# Altium schematic sheet RotorStator_PowerControl.SchDoc
size 431 x 279 mm; Date: 20260623; Author: YYC; CompanyName: M-Waves; SheetNumber: 1; SheetTotal: 1; SCH_SCALE: A3
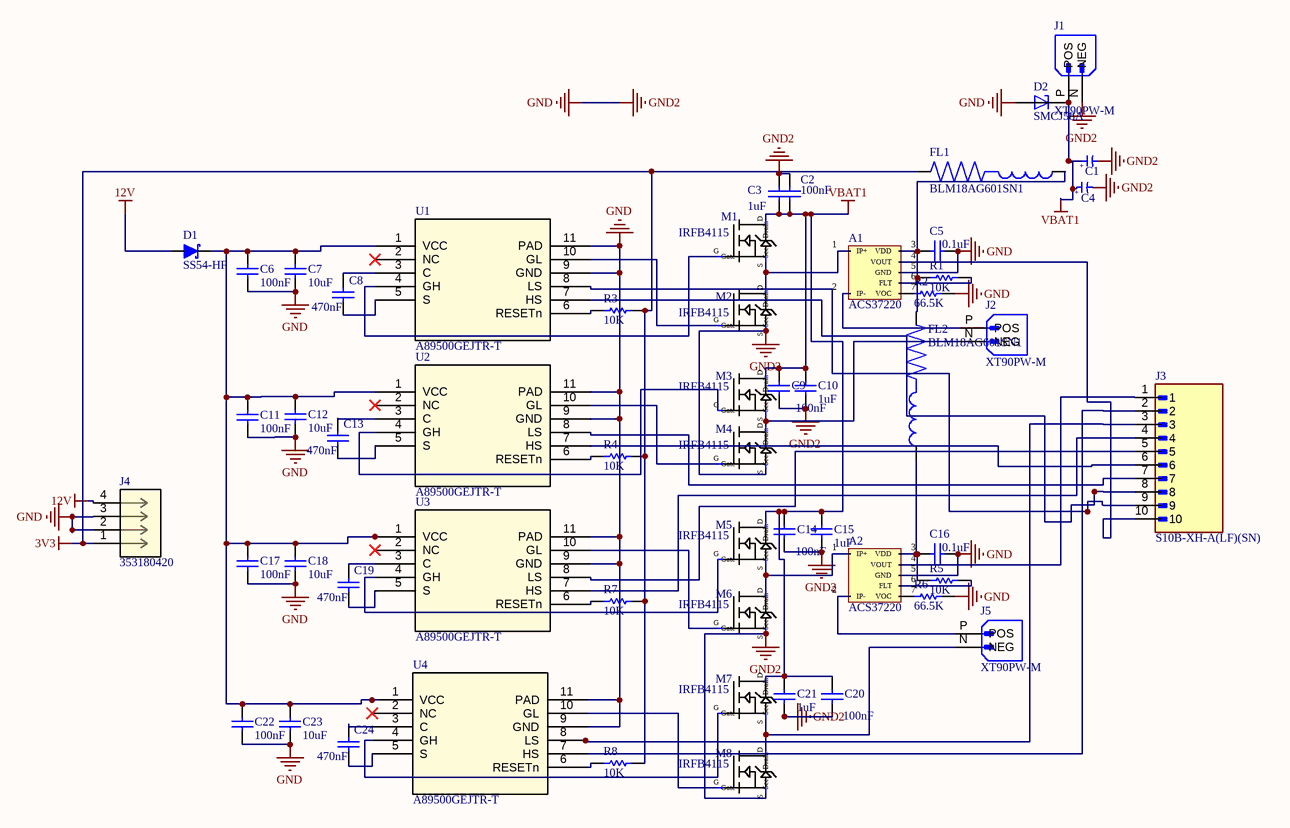
[diagram p0: RotorStator_PowerControl.SchDoc]

## Parts
A1  ACS37220  [ACS37220]
A2  ACS37220  [ACS37220]
C1  MAL215099913E3  [CAPAE1900X2200N]  (value not drawn)
C2  value 100nF  [CAP0805R]  (hidden comment: Capacitor)
C3  value 1uF  [CAP0805R]  (hidden comment: Capacitor)
C4  MAL215099913E3  [CAPAE1900X2200N]  (value not drawn)
C5  value 0.1uF  [CAP0805R]  (hidden comment: Capacitor)
C6  value 100nF  [CAP0805R]  (hidden comment: Capacitor)
C7  value 10uF  [CAP0805R]  (hidden comment: Capacitor)
C8  value 470nF  [CAP0805R]  (hidden comment: Capacitor)
C9  value 100nF  [CAP0805R]  (hidden comment: Capacitor)
C10  value 1uF  [CAP0805R]  (hidden comment: Capacitor)
C11  value 100nF  [CAP0805R]  (hidden comment: Capacitor)
C12  value 10uF  [CAP0805R]  (hidden comment: Capacitor)
C13  value 470nF  [CAP0805R]  (hidden comment: Capacitor)
C14  value 100nF  [CAP0805R]  (hidden comment: Capacitor)
C15  value 1uF  [CAP0805R]  (hidden comment: Capacitor)
C16  value 0.1uF  [CAP0805R]  (hidden comment: Capacitor)
C17  value 100nF  [CAP0805R]  (hidden comment: Capacitor)
C18  value 10uF  [CAP0805R]  (hidden comment: Capacitor)
C19  value 470nF  [CAP0805R]  (hidden comment: Capacitor)
C20  value 100nF  [CAP0805R]  (hidden comment: Capacitor)
C21  value 1uF  [CAP0805R]  (hidden comment: Capacitor)
C22  value 100nF  [CAP0805R]  (hidden comment: Capacitor)
C23  value 10uF  [CAP0805R]  (hidden comment: Capacitor)
C24  value 470nF  [CAP0805R]  (hidden comment: Capacitor)
D1  SS54-HF  [DIOM5025X220N]
D2  SMCJ58A  [DIOM7959X262N]
FL1  BLM18AG601SN1  [BEADC1608X95N]
FL2  BLM18AG601SN1  [BEADC1608X95N]
J1  XT90PW-M  [AMASS_XT90PW-M]
J2  XT90PW-M  [AMASS_XT90PW-M]
J3  S10B-XH-A(LF)(SN)  [JST_S10B-XH-A(LF)(SN)]
J4  353180420  [MOLEX_353180420]
J5  XT90PW-M  [AMASS_XT90PW-M]
M1  IRFB4115  [IRFB4115]
M2  IRFB4115  [IRFB4115]
M3  IRFB4115  [IRFB4115]
M4  IRFB4115  [IRFB4115]
M5  IRFB4115  [IRFB4115]
M6  IRFB4115  [IRFB4115]
M7  IRFB4115  [IRFB4115]
M8  IRFB4115  [IRFB4115]
R1  value 10K  [RES0805W]  (hidden comment: Resistor)
R2  value 66.5K  [RES0805W]  (hidden comment: Resistor)
R3  value 10K  [RES0805W]  (hidden comment: Resistor)
R4  value 10K  [RES0805W]  (hidden comment: Resistor)
R5  value 10K  [RES0805W]  (hidden comment: Resistor)
R6  value 66.5K  [RES0805W]  (hidden comment: Resistor)
R7  value 10K  [RES0805W]  (hidden comment: Resistor)
R8  value 10K  [RES0805W]  (hidden comment: Resistor)
U1  A89500GEJTR-T  [A89500GEJTR-T]
U2  A89500GEJTR-T  [A89500GEJTR-T]
U3  A89500GEJTR-T  [A89500GEJTR-T]
U4  A89500GEJTR-T  [A89500GEJTR-T]

## Nets
3V3: FL1.2 J4.1 R3.1 R4.1 R7.1 R8.1
12V: D1.2(A) J4.4
GND: A1.5(GND) A2.5(GND) C1.2 C2.2 C3.2 C4.2 C5.2 C6.2 C7.2 C9.2 C10.2 C11.2 C12.2 C14.2 C15.2 C16.2 C17.2 C18.2 C20.2 C21.2 C22.2 C23.2 D2.A J1.N(NEG) J4.2 J4.3 M2.S(Sce) M4.S(Sce) M6.S(Sce) M8.S(Sce) R2.2 R6.2 U1.9(GND) U1.11(PAD) U2.9(GND) U2.11(PAD) U3.9(GND) U3.11(PAD) U4.9(GND) U4.11(PAD)  [also labelled GND2]
VBAT1: C1.1 C2.1 C3.1 C4.1 C9.1 C10.1 C14.1 C15.1 C20.1 C21.1 D2.C J1.P(POS) M1.D(Drain) M3.D(Drain) M5.D(Drain) M7.D(Drain)
NetA1_1: A1.1(IP+) M1.S(Sce) M2.D(Drain)
NetA1_2: A1.2(IP-) J2.P(POS)
NetA1_3: A1.3(VDD) C5.1 FL1.1 FL2.2 R1.1
NetA1_4: A1.4(VOUT) J3.10
NetA1_6: A1.6(FLT) R1.2
NetA1_7: A1.7(VOC) R2.1
NetA2_1: A2.1(IP+) M5.S(Sce) M6.D(Drain)
NetA2_2: A2.2(IP-) J5.P(POS)
NetA2_3: A2.3(VDD) C16.1 FL2.1 R5.1
NetA2_4: A2.4(VOUT) J3.1
NetA2_6: A2.6(FLT) R5.2
NetA2_7: A2.7(VOC) R6.1
NetC6_1: C6.1 C7.1 C11.1 C12.1 C17.1 C18.1 C22.1 C23.1 D1.1(K) U1.1(VCC) U2.1(VCC) U3.1(VCC) U4.1(VCC)
NetC8_1: C8.1 U1.3(C)
NetC8_2: C8.2 U1.5(S)
NetC13_1: C13.1 U2.3(C)
NetC13_2: C13.2 U2.5(S)
NetC19_1: C19.1 U3.3(C)
NetC19_2: C19.2 U3.5(S)
NetC24_1: C24.1 U4.3(C)
NetC24_2: C24.2 U4.5(S)
NetJ2_N: J2.N(NEG) M3.S(Sce) M4.D(Drain)
NetJ3_2: J3.2 U4.7(HS)
NetJ3_3: J3.3 U4.8(LS)
NetJ3_4: J3.4 U3.7(HS)
NetJ3_5: J3.5 U3.8(LS)
NetJ3_6: J3.6 U2.7(HS)
NetJ3_7: J3.7 U2.8(LS)
NetJ3_8: J3.8 U1.7(HS)
NetJ3_9: J3.9 U1.8(LS)
NetJ5_N: J5.N(NEG) M7.S(Sce) M8.D(Drain)
NetM1_G: M1.G(Gate) U1.4(GH)
NetM2_G: M2.G(Gate) U1.10(GL)
NetM3_G: M3.G(Gate) U2.4(GH)
NetM4_G: M4.G(Gate) U2.10(GL)
NetM5_G: M5.G(Gate) U3.4(GH)
NetM6_G: M6.G(Gate) U3.10(GL)
NetM7_G: M7.G(Gate) U4.4(GH)
NetM8_G: M8.G(Gate) U4.10(GL)
NetR3_2: R3.2 U1.6(RESETn)
NetR4_2: R4.2 U2.6(RESETn)
NetR7_2: R7.2 U3.6(RESETn)
NetR8_2: R8.2 U4.6(RESETn)

Not connected (* = marked no-connect by the designer): U1 2(NC)*; U2 2(NC)*; U3 2(NC)*; U4 2(NC)*

## Notes on the sheet
- DWG. NO.
- REV.
- SHT.
- THIS DOCUMENT AND THE DATA DISCLOSED HEREIN OR HEREWITH IS THE PROPERTY OF ALTIUM LIMITED AND MAY BE FREELY DISTRIBUTED IN WHOLE. NO RIGHTS ARE RESERVED OR EXPRESS OR IMPLIED WARANTEE GIVEN.
- REVISION
- DESCRIPTION
- DATE
- APPROVED
- ENG:
- APPROVALS
- PROJECT
- DSN:
- CHK:
- REFERENCE DOCUMENTS
- PROJECT REVISION:
- TITLE
- DOCUMENT REVISION:
- DESIGN ITEM:
- BOM:
- FAB DWG:
- PCB DWG:
- ASSY DWG:
- SCALE:
- SIZE
- B
- CAGE CODE
- FILE NAME
- DWG NO.
- SHEET
- OF
- REV
- (in symbol MAL215099913E3) +

## Library data of the parts
C1 C4 = MAL215099913E3: Cap Aluminum Lytic 470uF 100V 20% (18 X 21mm) SMD 1450mA 5000h 105Â°C Automotive AEC-Q200 T/R; MF: Vishay Beyschlag/Draloric; SnapEDA_Link: https://www.snapeda.com/parts/MAL215099913E3/Vishay/view-part/?ref=snap; Package: None; Value: *; MP: MAL215099913E3; Check_prices: https://www.snapeda.com/parts/MAL215099913E3/Vishay/view-part/?ref=eda
C2 C3 C5-C24 = Capacitor: SimulationGenericComponent: True
D1 = SS54-HF: Diode Schottky 40 V 5A Surface Mount DO-214AC (SMA); MF: Comchip Technology; SnapEDA_Link: https://www.snapeda.com/parts/SS54-HF/Comchip/view-part/?ref=snap; Package: DO-214AC-214 Comchip Technology; Value: *; MP: SS54-HF; Check_prices: https://www.snapeda.com/parts/SS54-HF/Comchip/view-part/?ref=eda
D2 = SMCJ58A: 93.6V Clamp 16.1A Ipp Tvs Diode Surface Mount DO-214AB (SMC); MF: Fairchild Semiconductor; SnapEDA_Link: https://www.snapeda.com/parts/SMCJ58A/Fairchild+Imaging/view-part/?ref=snap; Package: DO-214 Fairchild Semiconductor; Value: *; MP: SMCJ58A; Check_prices: https://www.snapeda.com/parts/SMCJ58A/Fairchild+Imaging/view-part/?ref=eda
FL1 FL2 = BLM18AG601SN1: 600 Ohms @ 100 MHz 1 - Ferrite Bead 0603 (1608 Metric) 500mA 380mOhm; MF: Murata Electronics; SnapEDA_Link: https://www.snapeda.com/parts/BLM18AG601SN1/Murata+Electronics+North+America/view-part/?ref=snap; Package: 0603 Murata Electronics; Value: *; MP: BLM18AG601SN1; Check_prices: https://www.snapeda.com/parts/BLM18AG601SN1/Murata+Electronics+North+America/view-part/?ref=eda
J1 J2 J5 = XT90PW-M: Socket; DC supply; XT90; male; PIN: 2; on PCBs; THT; Colour: yellow; MF: AMASS; SnapEDA_Link: https://www.snapeda.com/parts/XT90PW-M/AMASS/view-part/?ref=snap; Package: Package; Value: *; MP: XT90PW-M; Check_prices: https://www.snapeda.com/parts/XT90PW-M/AMASS/view-part/?ref=eda
J4 = 353180420: Connector Header Through Hole, Right Angle 4 position 0.165in (4.20mm); Package: None; MP: 353180420; Value: *; Price: None; Availability: Unavailable
R1-R8 = Resistor: TC1: 0; SimulationGenericComponent: True; TC2: 0
U1-U4 = A89500GEJTR-T: Description; Manufacturer_Name: Allegro Microsystems Inc.; Copyright: Copyright (C) 2025 Ultra Librarian. All rights reserved.; Manufacturer_Part_Number: A89500GEJTR-T; RefDes: RefDes; Type: Type
J3 = S10B-XH-A(LF)(SN): Package: None; Price: None; Value: *; MP: S10B-XH-A(LF)(SN); Availability: Unavailable